# EAGLE design atmega48 (EAGLE 5.03)
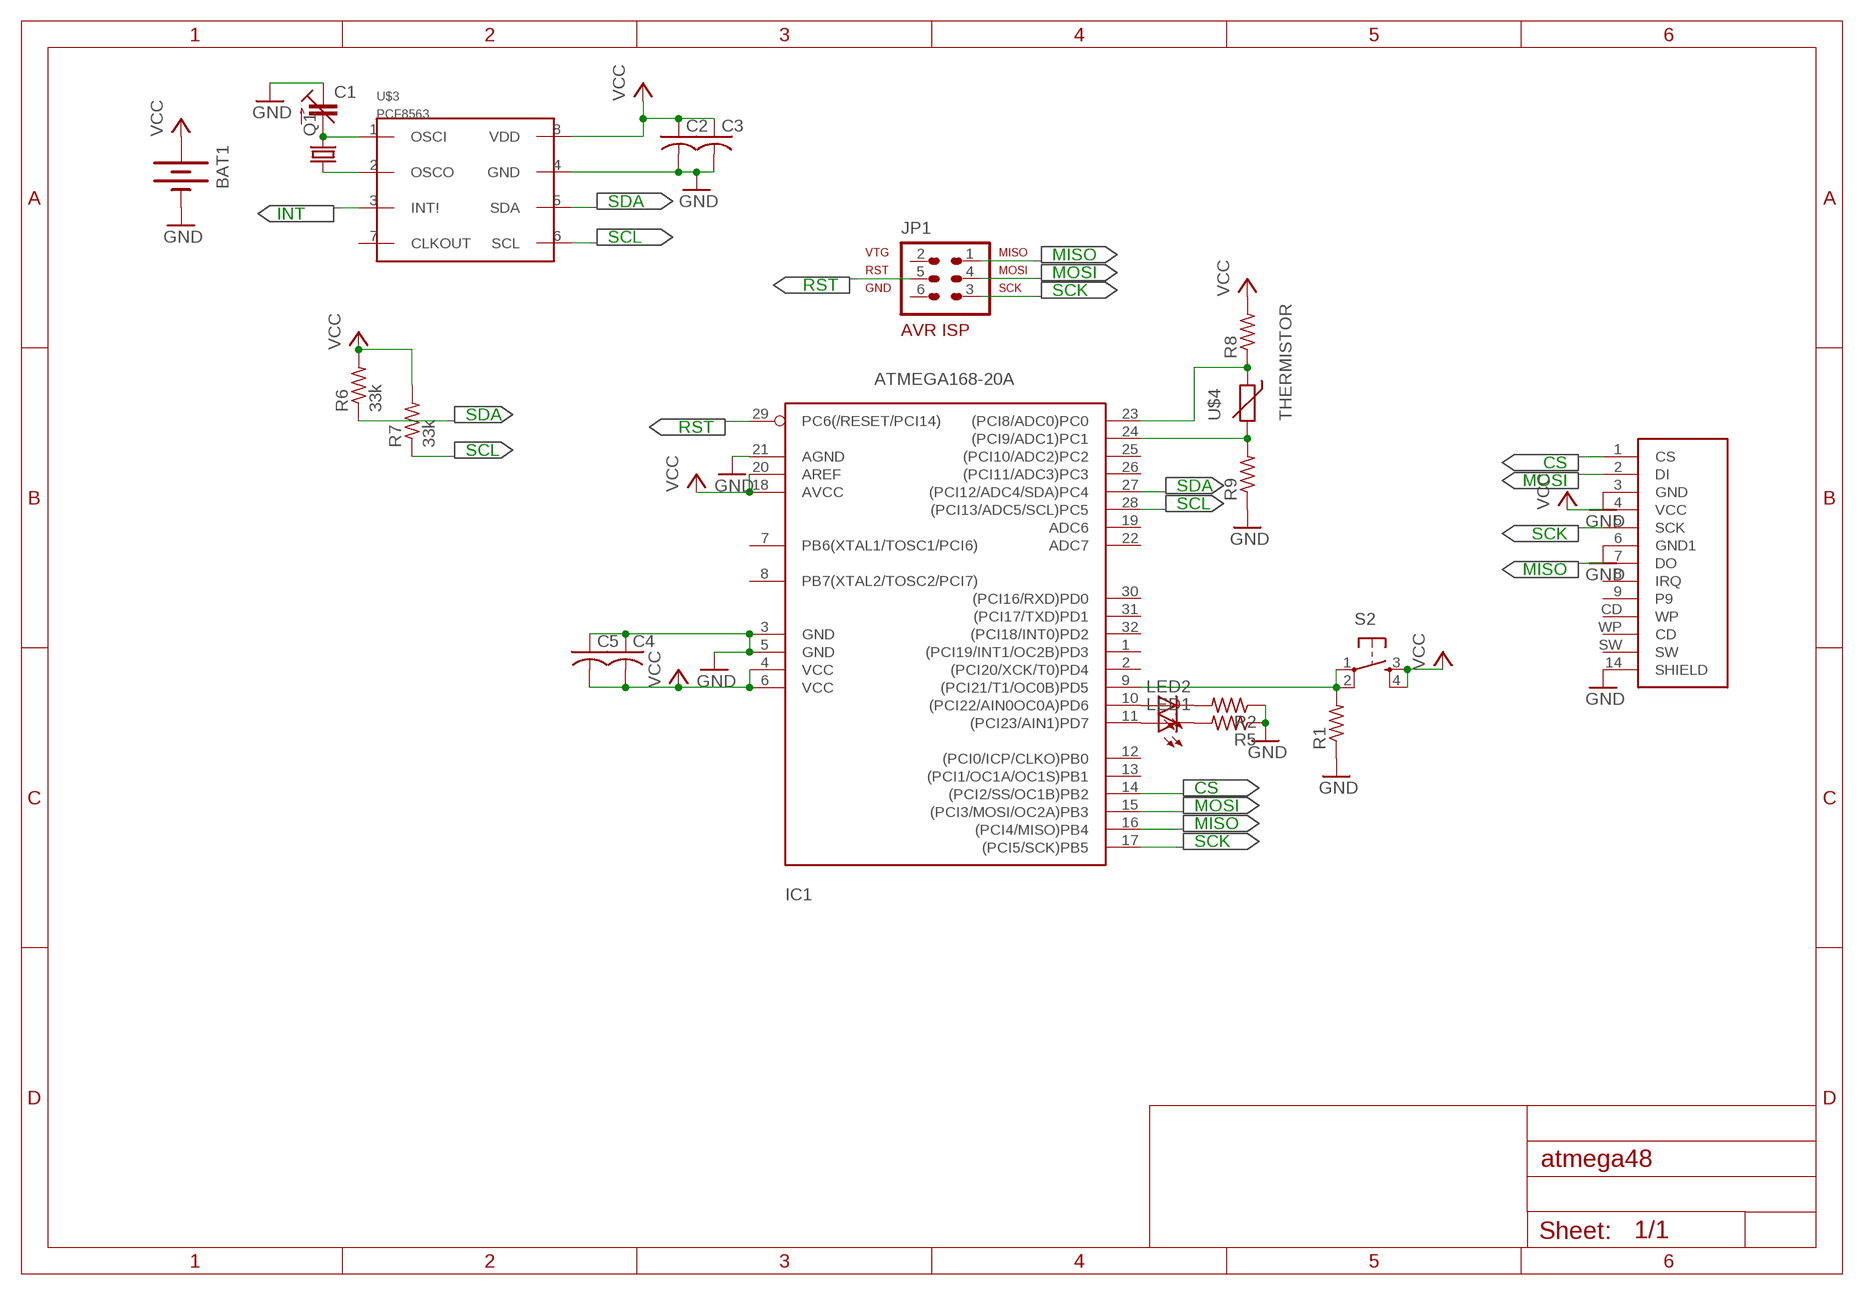
[diagram p0: schematic, sheet 1]

## Parts
BAT1  BATTERY20SMD  [BATTCON_20MM]
C1  C-TRIMM3018_11  [CTRIM3018_11]
C2  C-USC0603  [C0603]
C3  C-USC0603  [C0603]
C4  C-USC0603  [C0603]
C5  C-USC0603  [C0603]
IC1  ATMEGA168-20A  [TQFP32-08]
JP1  AVR-ISP-6  [AVR-ISP-6]
LED1  LEDCHIP-LED0603  [CHIP-LED0603]
LED2  LEDCHIP-LED0603  [CHIP-LED0603]
Q1  CRYSTAL5X3  [CRYSTAL-SMD-5X3]
R1  R-US_R0603  [R0603]
R2  R-US_R0603  [R0603]
R5  R-US_R0603  [R0603]
R6  33k  R-US_R0603  [R0603]
R7  33k  R-US_R0603  [R0603]
R8  R-US_R0603  [R0603]
R9  R-US_R0603  [R0603]
S2  TAC_SWITCHSMD  [TACTILE_SWITCH_SMD]
U$1  SD_CARD_SOCKETSD  [SD-MMC_SOCKET-PP]
U$3  PCF8563  [SO8]
U$4  THERMISTOR  [0603]

## Nets
CS: IC1.14((PCI2/SS/OC1B)PB2) U$1.1(CS)
GND: BAT1.2(-) C1.+(E) C2.2 C3.2 C4.1 C5.1 IC1.3(GND) IC1.5(GND) IC1.21(AGND) R1.1 R2.1 R5.1 R9.1 U$1.3(GND) U$1.6(GND1) U$1.14(SHIELD) U$3.4(GND)
MISO: IC1.16((PCI4/MISO)PB4) JP1.1 U$1.7(DO)
MOSI: IC1.15((PCI3/MOSI/OC2A)PB3) JP1.4 U$1.2(DI)
N$1: IC1.11((PCI23/AIN1)PD7) LED1.A
N$2: U$3.3(INT!)
N$3: IC1.10((PCI22/AIN0OC0A)PD6) LED2.A
N$4: IC1.23((PCI8/ADC0)PC0) R8.1 U$4.1
N$5: IC1.24((PCI9/ADC1)PC1) R9.2 U$4.2
N$12: R1.2 S2.1 S2.2
N$15: LED2.C R2.2
N$16: LED1.C R5.2
N$17: C1.-(A) Q1.3 U$3.1(OSCI)
N$18: Q1.1 U$3.2(OSCO)
RST: IC1.29(PC6(/RESET/PCI14)) JP1.5
SCK: IC1.17((PCI5/SCK)PB5) JP1.3 U$1.5(SCK)
SCL: R7.1 U$3.6(SCL)
SDA: R6.1 U$3.5(SDA)
VCC: BAT1.1(+) C2.1 C3.1 C4.2 C5.2 IC1.4(VCC) IC1.6(VCC) IC1.18(AVCC) IC1.20(AREF) R6.2 R7.2 R8.2 S2.3 S2.4 U$1.4(VCC) U$3.8(VDD)
Unconnected: IC1.1((PCI19/INT1/OC2B)PD3) IC1.2((PCI20/XCK/T0)PD4) IC1.7(PB6(XTAL1/TOSC1/PCI6)) IC1.8(PB7(XTAL2/TOSC2/PCI7)) IC1.9((PCI21/T1/OC0B)PD5) IC1.12((PCI0/ICP/CLKO)PB0) IC1.13((PCI1/OC1A/OC1S)PB1) IC1.19(ADC6) IC1.22(ADC7) IC1.25((PCI10/ADC2)PC2) IC1.26((PCI11/ADC3)PC3) IC1.27((PCI12/ADC4/SDA)PC4) IC1.28((PCI13/ADC5/SCL)PC5) IC1.30((PCI16/RXD)PD0) IC1.31((PCI17/TXD)PD1) IC1.32((PCI18/INT0)PD2) JP1.2 JP1.6 U$1.8(IRQ) U$1.9 U$1.CD(WP) U$1.SW U$1.WP(CD) U$3.7(CLKOUT)

## Notes on the sheet
- INT | SDA
- SCL
- MISO
- RST | MOSI
- SCK
- SDA | RST
- SCL | CS
- MOSI
- SDA
- SCL
- SCK
- MISO
- CS
- MOSI
- MISO
- SCK

## Library data of the parts
BAT1 = SparkFun:BATTERY: Battery Holders Various common sizes : AA, AAA, 20mm coin cell and 12mm coin cell.
C1 = rcl:C-TRIMM: Trimm capacitor
C2-C5 = rcl:C-US: CAPACITOR, American symbol
IC1 = avr:ATMEGA168: MICROCONTROLLER 16 kBytes FLASH 1 kBytes SRAM 512 Bytes EEPROM USART 8-channel 10 bit ADC
JP1 = atmel-1:AVR-ISP-6: AVR ISP-6 Serial Programming Header
LED1 LED2 = led:LED: LED OSRAM: - CHIPLED LG R971, LG N971, LY N971, LG Q971, LY Q971, LO R971, LY R971 LH N974, LH R974 LS Q976, LO Q976, LY Q976 LO Q996 - Hyper CHIPLED LW Q18S LB Q993, LB Q99A, LB R99A - SideLED LS A670, LO A670, LY A670, LG A670, LP A670 LB A673, LV A673, LT A673, LW A673 LH A674 LY A675 LS A676, LA A676, LO A676, LY A676, LW A676 LS A679, LY A679, LG A679 - Hyper Micro SIDELED® LS Y876, LA Y876, LO Y876, LY Y876 LT Y87S - SmartLED LW L88C, LW L88S LB L89C, LB L89S, LG L890 LS L89K, LO L89K, LY L89K LS L896, LA L896, LO L896, LY L896 - TOPLED LS T670, LO T670, LY T670, LG T670, LP T670 LSG T670, LSP T670, LSY T670, LOP T670, LYG T670 LG T671, LOG T671, LSG T671 LB T673, LV T673, LT T673, LW T673 LH T674 LS T676, LA T676, LO T676, LY T676, LB T676, LH T676, LSB T676, LW T676 LB T67C, LV T67C, LT T67C, LS T67K, LO T67K, LY T67K, LW E67C LS E67B, LA E67B, LO E67B, LY E67B, LB E67C, LV E67C, LT E67C LW T67C LS T679, LY T679, LG T679 LS T770, LO T770, LY T770, LG T770, LP T770 LB T773, LV T773, LT T773, LW T773 LH T774 LS E675, LA E675, LY E675, LS T675 LS T776, LA T776, LO T776, LY T776, LB T776 LHGB T686 LT T68C, LB T68C - Hyper Mini TOPLED® LB M676 - Mini TOPLED Santana® LG M470 LS M47K, LO M47K, LY M47K Source: http://www.osram.convergy.de - LUMILED® LXK2-PW12-R00, LXK2-PW12-S00, LXK2-PW14-U00, LXK2-PW14-V00 LXK2-PM12-R00, LXK2-PM12-S00, LXK2-PM14-U00 LXK2-PE12-Q00, LXK2-PE12-R00, LXK2-PE12-S00, LXK2-PE14-T00, LXK2-PE14-U00 LXK2-PB12-K00, LXK2-PB12-L00, LXK2-PB12-M00, LXK2-PB14-N00, LXK2-PB14-P00, LXK2-PB14-Q00 LXK2-PR12-L00, LXK2-PR12-M00, LXK2-PR14-Q00, LXK2-PR14-R00 LXK2-PD12-Q00, LXK2-PD12-R00, LXK2-PD12-S00 LXK2-PH12-R00, LXK2-PH12-S00 LXK2-PL12-P00, LXK2-PL12-Q00, LXK2-PL12-R00 Source: www.luxeon.com
Q1 = SparkFun:CRYSTAL: Crystals Various standard crystals. Proven footprints. Spark Fun Electronics SKU : COM-00534
R1 R2 R5-R9 = rcl:R-US_: RESISTOR, American symbol
S2 = SparkFun:TAC_SWITCH: Momentary Switch Button commonly used for reset or general input. Spark Fun Electronics SKU : COM-00097
U$1 = SparkFun:SD_CARD_SOCKET: SD/MMC Socket Media socket for SD and MMC cards. Push-push type. Schematic element and footprint production proven. Spark Fun Electronics SKU : PRT-00136
U$3 = nublabs:PCF8563
U$4 = nublabs:THERMISTOR

## Board
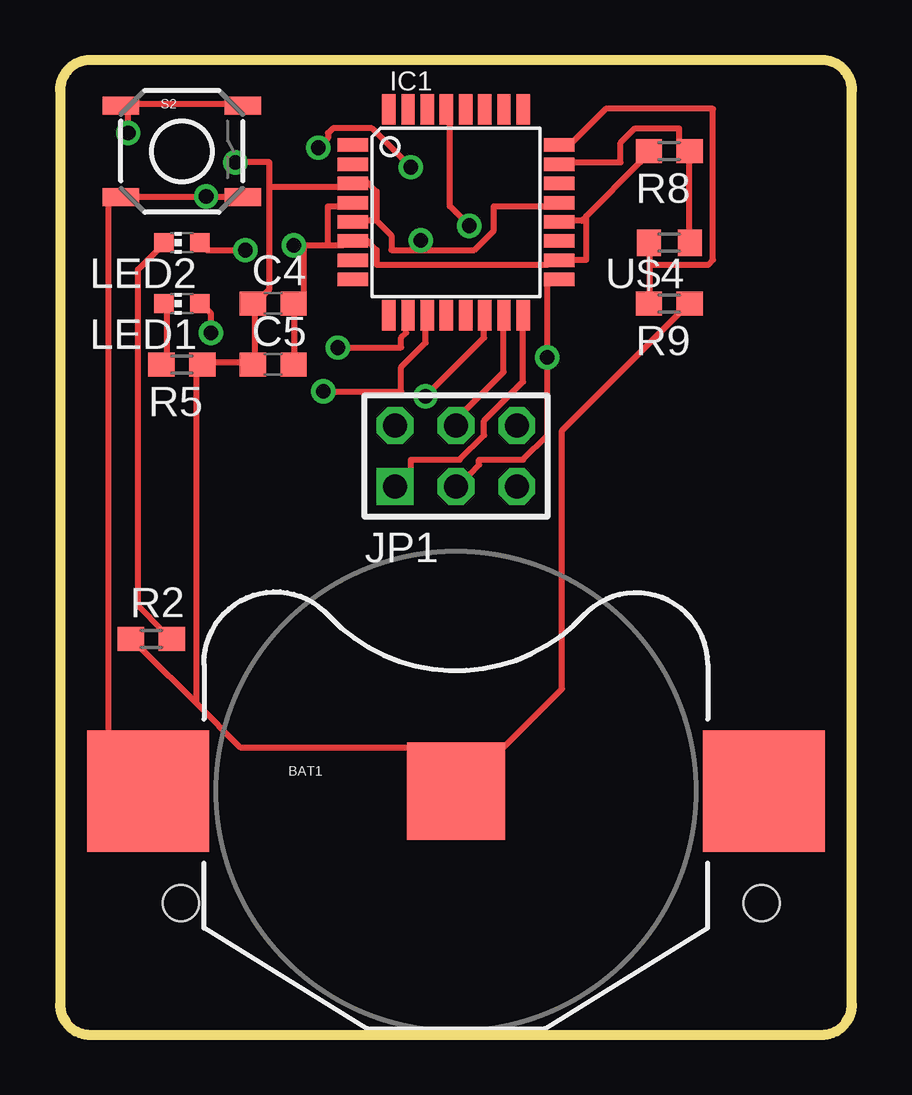
[diagram p1: board, top side]
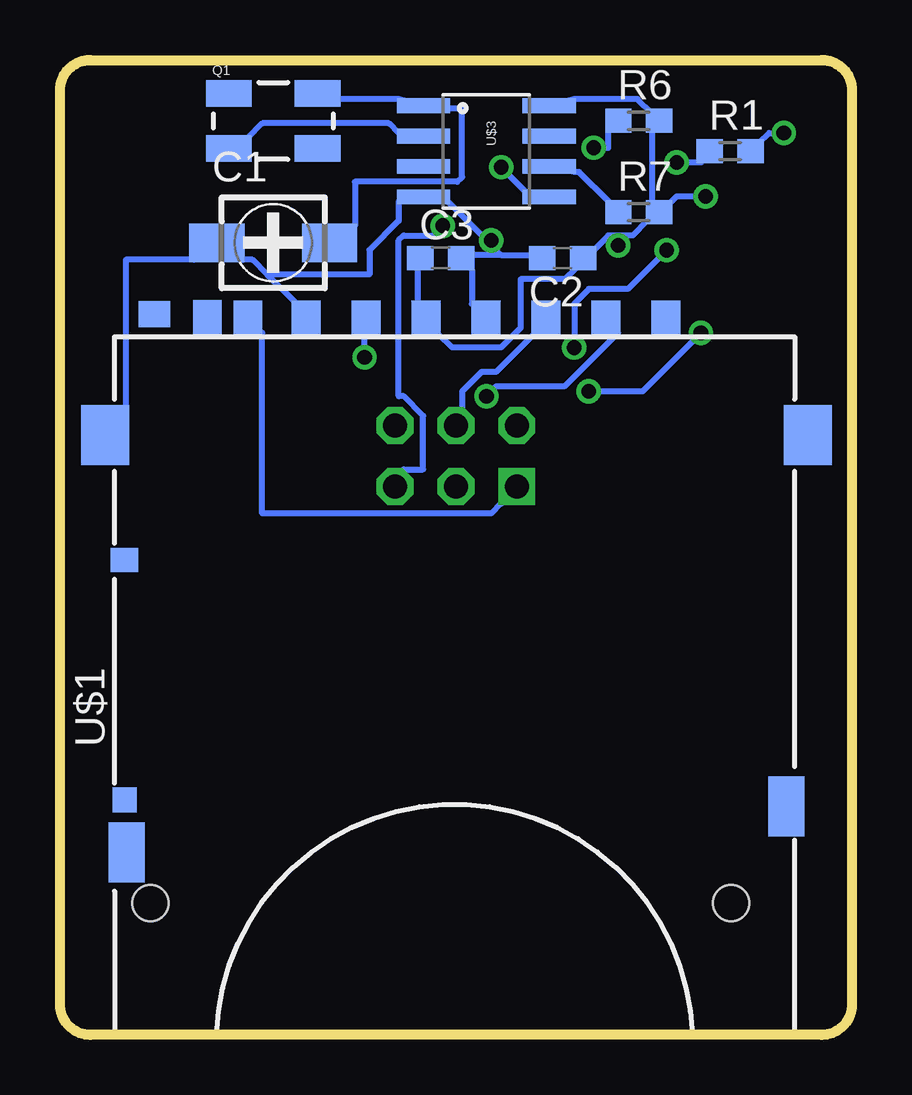
[diagram p2: board, bottom side, seen from below]

Size 33.02 x 40.64 mm. Coordinates in mm from the lower left corner, seen from the top.
Outline: 31.75,0 arc90 33.02,1.27 33.02,39.37 arc90 31.75,40.64 1.27,40.64 arc90 0,39.37 0,1.27 arc90 1.27,0 31.75,0
Copper layers (1*16): Top 0.035mm / dielectric 1.5mm / Bottom 0.035mm
Design rules "default": minimum track width 10mil, minimum drill 24mil, track to track 8mil, track to pad 8mil, pad to pad 8mil, via to via 8mil, smd to smd 8mil, copper to edge 40mil, drill to drill 8mil, minimum pad ring 10mil, minimum via ring 8mil, stop-mask expansion 4mil, vias tented up to drill 0mil, thermal gap 10mil

### Footprints (pad centres in the part's own frame; a part is rotated, then mirrored left to right if it is on the bottom)
BATTCON_20MM = smd 5.08 x 5.08: 1 -12.827,0; 3 12.827,0 | smd 4.064 x 4.064: 2 0,0
CTRIM3018_11 = smd 2.3 x 1.6: + -2.35,0; - 2.35,0
C0603 = smd 1.1 x 1: 1 -0.85,0; 2 0.85,0
TQFP32-08 = smd 1.27 x 0.559: 1 -4.293,2.8; 2 -4.293,2; 3 -4.293,1.2; 4 -4.293,0.4; 5 -4.293,-0.4; 6 -4.293,-1.2; 7 -4.293,-2; 8 -4.293,-2.8; 17 4.293,-2.8; 18 4.293,-2; 19 4.293,-1.2; 20 4.293,-0.4; 21 4.293,0.4; 22 4.293,1.2; 23 4.293,2; 24 4.293,2.8 | smd 0.559 x 1.27: 9 -2.8,-4.293; 10 -2,-4.293; 11 -1.2,-4.293; 12 -0.4,-4.293; 13 0.4,-4.293; 14 1.2,-4.293; 15 2,-4.293; 16 2.8,-4.293; 25 2.8,4.293; 26 2,4.293; 27 1.2,4.293; 28 0.4,4.293; 29 -0.4,4.293; 30 -1.2,4.293; 31 -2,4.293; 32 -2.8,4.293
AVR-ISP-6 = drill 1.016 square: 1 -2.54,-1.27 | drill 1.016 octagon: 2 -2.54,1.27; 3 0,-1.27; 4 0,1.27; 5 2.54,-1.27; 6 2.54,1.27
CHIP-LED0603 = smd 0.8 x 0.8: A 0,-0.75; C 0,0.75
CRYSTAL-SMD-5X3 = smd 1.9 x 1.1: 1 -1.85,-1.15; 2 1.85,-1.15; 3 1.85,1.15; 4 -1.85,1.15
R0603 = smd 1.1 x 1: 1 -0.85,0; 2 0.85,0
TACTILE_SWITCH_SMD = smd 1.524 x 0.762: 1 -2.54,1.905; 2 2.54,1.905; 3 -2.54,-1.905; 4 2.54,-1.905
SD-MMC_SOCKET-PP = smd 1.2 x 1.5: 1 6.88,29.85; 2 4.38,29.85; 3 1.88,29.85; 4 -0.62,29.85; 5 -3.12,29.85; 6 -5.62,29.85; 7 -8.04,29.85; 8 -9.728,29.87; 9 9.38,29.85 | smd 1.5 x 2.5: 12 -13.1,7.6; 13 14.402,9.525 | smd 2 x 2.5: 14 -14,25; 15 15.3,25 | smd 1.15 x 1: CD -13.18,19.8 | smd 1.3 x 1.1: SW -11.938,30.048 | smd 1 x 1.05: WP -13.18,9.8 | hole 1.5: -12.1,5.5; 12.1,5.5
SO8 = smd 0.61 x 2.21: 1 -1.905,-2.616; 2 -0.635,-2.616; 3 0.635,-2.616; 4 1.905,-2.616; 5 1.905,2.616; 6 0.635,2.616; 7 -0.635,2.616; 8 -1.905,2.616
0603 = smd 1 x 1.1: 1 -0.85,1.27; 2 0.85,1.27

### Placement (x,y rotation side)
BAT1  16.51,10.16 0 top
C1  24.13,33.02 0 bottom
C2  12.06,32.38 180 bottom
C3  17.14,32.38 0 bottom
C4  8.89,30.48 0 top
C5  8.89,27.94 0 top
IC1  16.51,34.29 0 top
JP1  16.51,24.13 0 top
LED1  5.08,30.48 90 top
LED2  5.08,33.02 90 top
Q1  24.13,38.1 0 bottom
R1  5.08,36.83 0 bottom
R2  3.81,16.51 0 top
R5  5.08,27.94 180 top
R6  8.89,38.1 0 bottom
R7  8.89,34.29 0 bottom
R8  25.4,36.83 180 top
R9  25.4,30.48 180 top
S2  5.08,36.83 0 top
U$1  17.14,0 0 bottom
U$3  15.24,36.83 270 bottom
U$4  25.4,34.29 180 top

### Tracks (layer width: path | path; a pad name or v marks a point on that pad's centre or on a via)
CS  (via drill 0.61)
  Top 0.254: v15.24,26.62 17.68,29.06 17.68,29.46 IC1.14
  Bottom 0.254: v15.24,26.62 14.83,27.03 11.99,27.03 9.75,29.26 U$1.1
GND  (via drill 0.61)
  Top 0.254: v7.32,36.37 8.74,36.37 8.74,35.36 | 8.74,35.36 8.74,31.09 8.53,30.89 C4.1 8.13,30.07 8.13,28.25 C5.1 7.52,28.04 6.3,28.04 R5.1 5.69,27.64 5.69,13.82 | 13.21,33.93 12.8,33.93 IC1.5 | 13.21,33.93 13.21,35.15 12.8,35.56 IC1.3 11.79,35.36 8.74,35.36 | 15.04,32.72 13.82,32.72 13.82,33.33 13.21,33.93 | 15.04,32.72 17.27,32.72 18.09,33.53 18.09,34.54 20.32,34.54 IC1.21 | 5.69,13.82 7.52,11.99 14.63,11.99 BAT1.2 18.49,11.99 20.93,14.43 20.93,25.2 25.81,30.07 R9.1 | 5.69,13.82 3.45,16.05 R2.1 | 15.04,32.72 v15.04,33.12
  Bottom 0.254: 14.63,32.51 15.85,32.51 C3.2 15.85,31.9 15.85,30.48 U$1.3 | 14.63,32.51 13.41,32.51 C2.2 | 15.24,33.12 14.63,32.51 | 15.24,33.12 16.87,34.75 U$3.4 18.9,34.75 18.9,33.93 20.12,32.72 20.12,31.7 24.38,31.7 | 24.38,31.7 24.99,32.31 25.4,32.31 C1.+ 27.43,32.31 30.28,32.31 30.28,26.21 U$1.14 | 24.38,31.7 23.16,30.48 U$1.6 | v7.32,36.37 6.3,36.37 R1.1 | v15.04,33.12 15.24,33.12
MISO
  Top 0.254: IC1.16 19.3,29.46 19.3,27.23 17.68,25.6 17.68,24.99 16.66,23.98 14.63,23.98 14.63,23.57 JP1.1
  Bottom 0.254: U$1.7 24.59,29.26 24.59,21.74 15.04,21.74 14.63,22.15 JP1.1
MOSI
  Top 0.254: IC1.15 18.49,29.46 18.49,27.64 16.87,26.01 JP1.4
  Bottom 0.254: U$1.2 13.21,29.26 14.83,27.64 15.44,27.64 16.26,26.82 16.26,26.01 JP1.4
N$1  (via drill 0.61)
  Top 0.254: v6.3,29.26 6.3,30.07 6.1,30.28 LED1.A | v10.97,26.82 14.22,26.82 14.22,27.84 15.24,28.85 15.24,29.46 IC1.11
  Bottom 0.254: v6.3,29.26 8.74,26.82 v10.97,26.82
N$3  (via drill 0.61)
  Top 0.254: v7.72,32.72 6.1,32.72 LED2.A | v11.58,28.65 14.22,28.65 14.22,29.06 14.43,29.26 14.43,29.46 IC1.10
  Bottom 0.254: v7.72,32.72 9.35,31.09 10.97,31.09 11.58,30.48 v11.58,28.65
N$4
  Top 0.254: U$4.1 26.21,33.53 26.21,36.37 R8.1 25.81,37.19 25.81,37.8 23.98,37.8 23.37,37.19 23.37,36.37 21.34,36.37 IC1.23
N$5
  Top 0.254: 24.59,32.11 24.59,32.51 U$4.2 | 24.59,32.11 24.59,30.89 R9.2 | 24.59,32.11 27.03,32.11 27.23,32.31 27.23,38.61 22.76,38.61 21.34,37.19 IC1.24
N$12  (via drill 0.61)
  Top 0.254: v2.85,37.59 2.85,38.41 S2.1 3.25,38.81 6.91,38.81 S2.2
  Bottom 0.254: v2.85,37.59 3.45,37.59 3.86,37.19 R1.2
N$15
  Top 0.254: LED2.C 4.06,32.72 3.25,31.9 3.25,17.88 4.27,16.87 R2.2
N$16
  Top 0.254: LED1.C 4.47,30.28 4.47,28.25 R5.2
N$17
  Bottom 0.254: Q1.3 21.34,39.01 18.9,39.01 U$3.1 16.87,38.61 16.26,38.61 16.26,35.76 16.46,35.56 20.73,35.56 20.73,33.73 C1.-
N$18
  Bottom 0.254: Q1.1 25.2,37.39 24.59,38 19.3,38 18.9,37.59 U$3.2
RST  (via drill 0.61)
  Top 0.254: v17.07,33.73 16.26,34.54 16.26,38 IC1.29
  Bottom 0.254: v17.07,33.73 17.48,33.33 18.69,33.33 18.9,33.12 18.9,26.62 18.69,26.62 17.88,25.81 17.88,23.57 18.69,23.57 JP1.5
SCK  (via drill 0.61)
  Top 0.254: IC1.17 20.32,31.29 v20.32,28.25 20.32,24.99 19.3,23.98 17.48,23.98 17.48,23.77 17.07,23.37 JP1.3
  Bottom 0.254: v20.32,28.25 20.32,29.26 U$1.5
SCL
  Bottom 0.254: R7.1 10.16,34.75 11.38,35.97 11.58,35.97 U$3.6
SDA  (via drill 0.61)
  Top 0.254: v10.77,36.98 11.18,37.39 11.18,37.59 11.38,37.8 13.01,37.8 v14.63,36.17
  Bottom 0.254: v10.77,36.98 10.16,36.98 10.16,37.8 R6.1 | v14.63,36.17 13.61,35.15 U$3.5
VCC  (via drill 0.61)
  Top 0.254: 21.95,34.14 21.74,33.93 21.34,33.93 IC1.20 | 21.95,34.14 24.18,36.37 R8.2 | 21.95,34.14 21.95,32.31 21.34,32.31 IC1.18 20.32,32.11 13.21,32.11 13.21,32.72 12.8,33.12 IC1.6 11.79,32.92 11.18,32.92 | C5.2 9.75,28.25 9.75,30.07 C4.2 10.16,30.89 10.16,32.92 | 10.16,32.92 11.18,32.92 | 11.18,32.92 11.18,34.54 11.79,34.54 IC1.4 | v9.75,32.92 10.16,32.92 | S2.4 6.91,34.95 v6.1,34.95 3.25,34.95 S2.3 2.03,34.75 2.03,12.6 BAT1.1
  Bottom 0.254: C3.1 18.09,31.9 18.09,30.48 U$1.4 17.27,29.26 16.66,28.65 14.63,28.65 13.82,29.46 13.82,31.5 11.99,31.5 11.58,31.9 C2.1 10.77,32.72 10.16,33.33 9.75,33.33 | 9.75,33.33 9.14,33.33 8.53,33.93 R7.2 | R7.2 8.33,34.75 8.33,37.8 R6.2 8.33,38.41 8.94,39.01 11.58,39.01 U$3.8 | 9.75,33.33 v9.75,32.92 | v6.1,34.95 7.32,34.95 7.52,34.75 R7.2